# EAGLE design main (EAGLE 8.7.0)
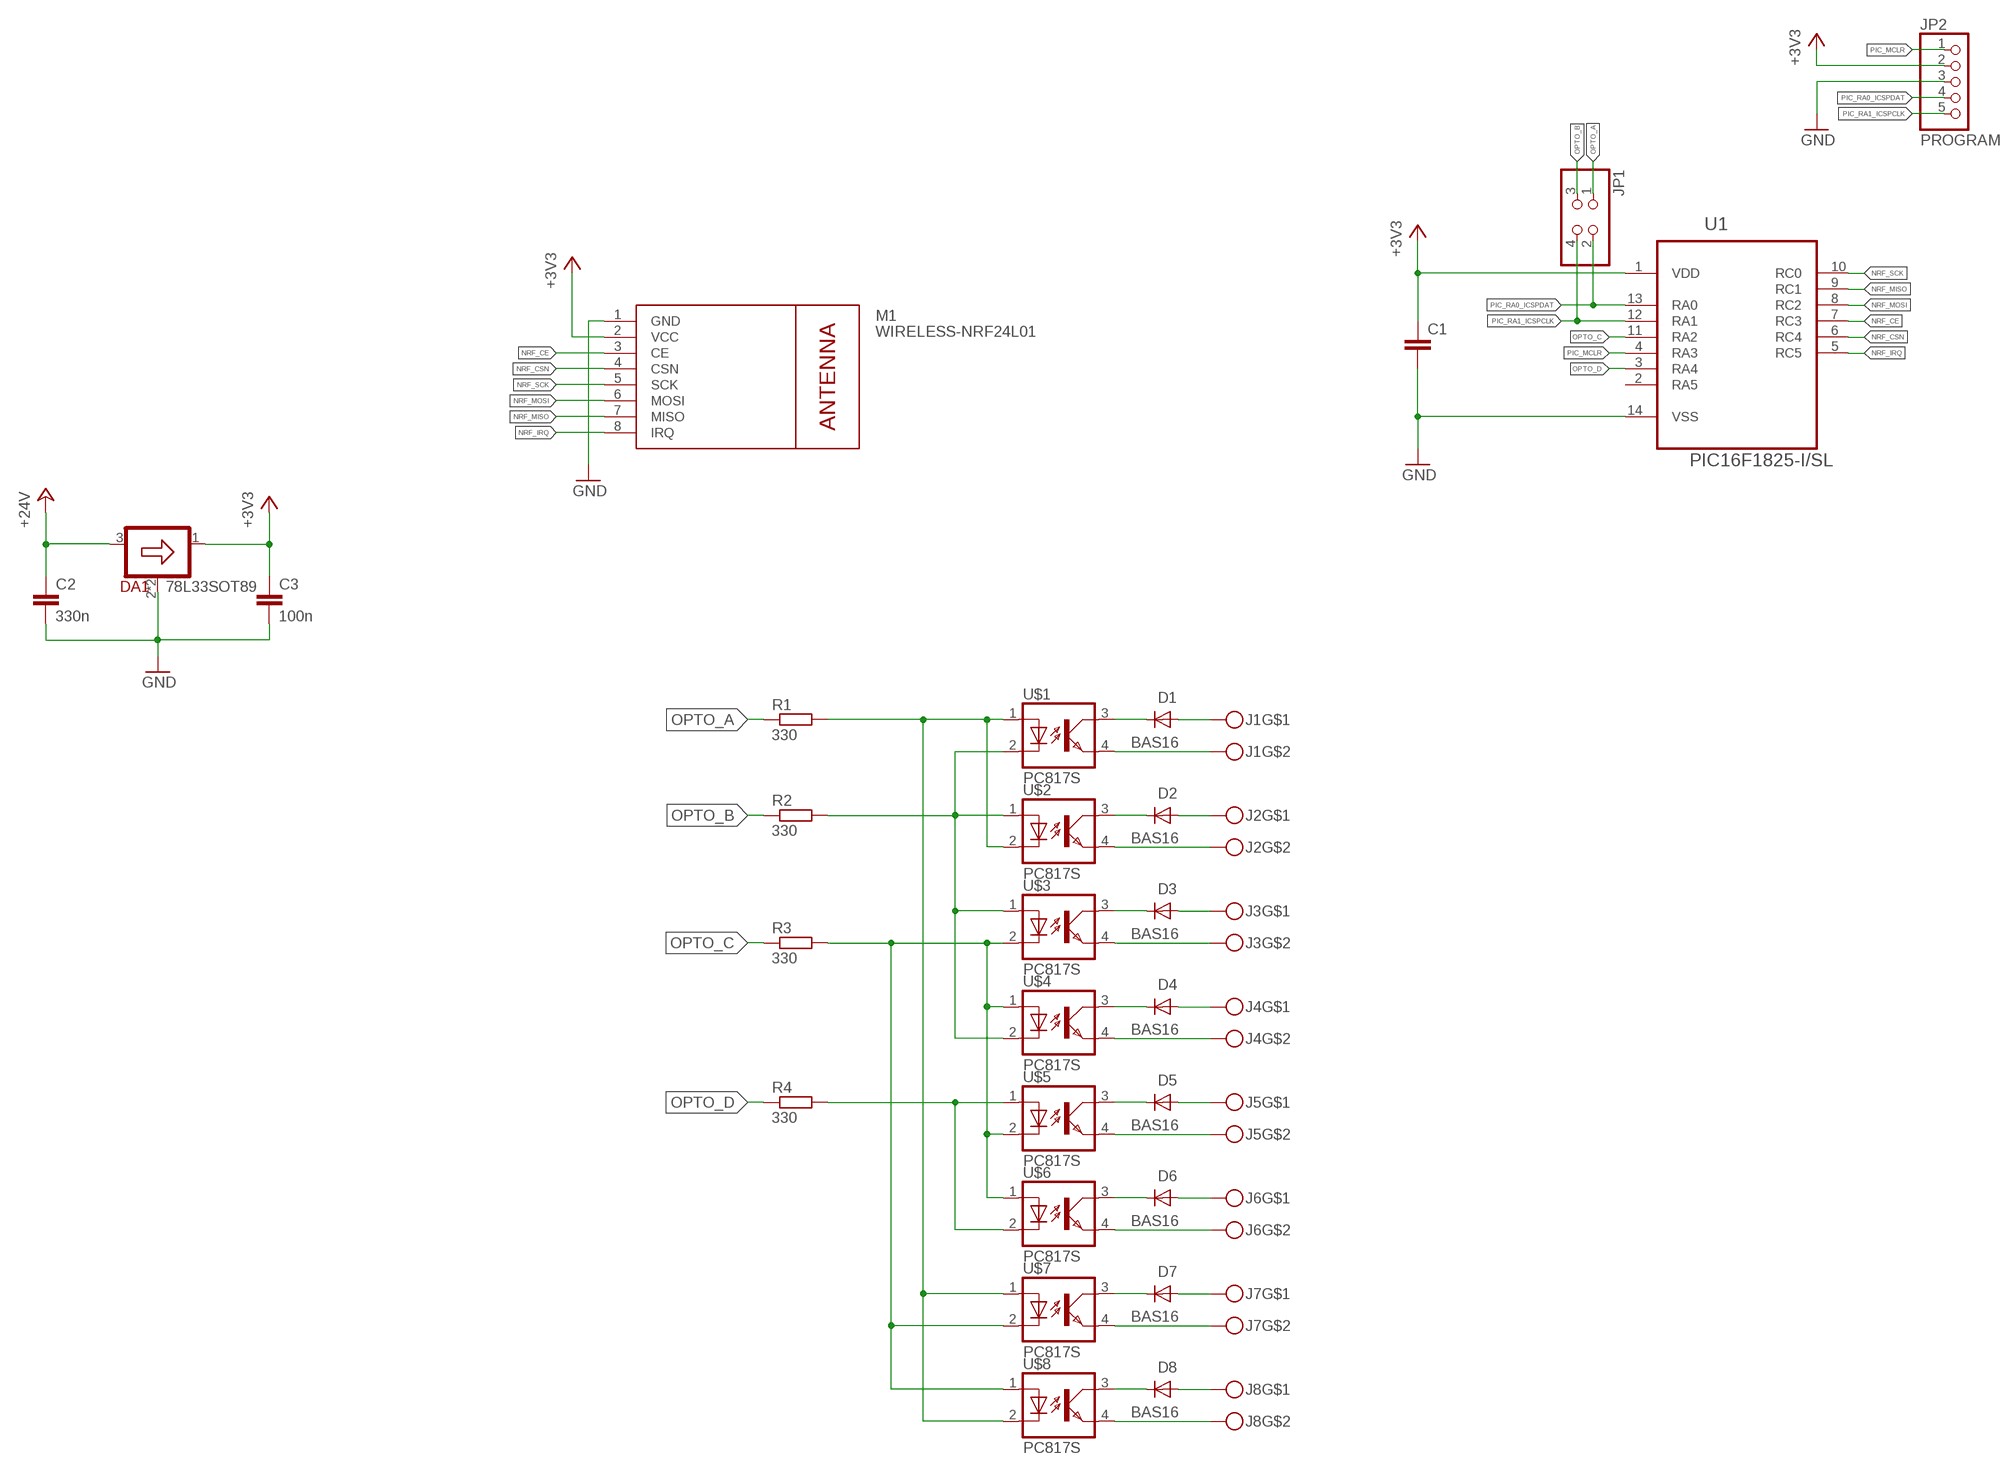
[diagram p0: schematic, sheet 1]

## Parts
C1  C-EUC1206  [C1206]
C2  330n  C-EUC1206  [C1206]
C3  100n  C-EUC1206  [C1206]
D1  BAS16  [SOT23]
D2  BAS16  [SOT23]
D3  BAS16  [SOT23]
D4  BAS16  [SOT23]
D5  BAS16  [SOT23]
D6  BAS16  [SOT23]
D7  BAS16  [SOT23]
D8  BAS16  [SOT23]
DA1  78L33SOT89  [SOT89]
J1  SCREW-TERMINAL-2PIN  [PITCH4.3-PIN2]
J2  SCREW-TERMINAL-2PIN  [PITCH4.3-PIN2]
J3  SCREW-TERMINAL-2PIN  [PITCH4.3-PIN2]
J4  SCREW-TERMINAL-2PIN  [PITCH4.3-PIN2]
J5  SCREW-TERMINAL-2PIN  [PITCH4.3-PIN2]
J6  SCREW-TERMINAL-2PIN  [PITCH4.3-PIN2]
J7  SCREW-TERMINAL-2PIN  [PITCH4.3-PIN2]
J8  SCREW-TERMINAL-2PIN  [PITCH4.3-PIN2]
JP1  PINHD-2X2  [2X02]
JP2  PROGRAM  PINHD-1X5  [1X05]
M1  WIRELESS-NRF24L01  [WIRELESS-NRF24L01]
R1  330  R-EU_R1206  [R1206]
R2  330  R-EU_R1206  [R1206]
R3  330  R-EU_R1206  [R1206]
R4  330  R-EU_R1206  [R1206]
U1  PIC16F1825-I/SL  [SOIC127P600X175-14N]
U$1  PC817S  [SMD4-7]
U$2  PC817S  [SMD4-7]
U$3  PC817S  [SMD4-7]
U$4  PC817S  [SMD4-7]
U$5  PC817S  [SMD4-7]
U$6  PC817S  [SMD4-7]
U$7  PC817S  [SMD4-7]
U$8  PC817S  [SMD4-7]

## Nets
+3V3: C1.1 C3.1 DA1.1(OUT) JP2.2 M1.2(VCC) U1.1(VDD)
+24V: C2.1 DA1.3(IN)
GND: C1.2 C2.2 C3.2 DA1.2(GND) DA1.2@1(GND) JP2.3 M1.1(GND) U1.14(VSS)
N$1: R2.2 U$1.2(C) U$2.1(A) U$3.1(A) U$4.2(C)
N$2: R1.2 U$1.1(A) U$2.2(C) U$7.1(A) U$8.2(C)
N$3: R3.2 U$3.2(C) U$4.1(A) U$5.2(C) U$6.1(A) U$7.2(C) U$8.1(A)
N$4: R4.2 U$5.1(A) U$6.2(C)
N$5: D1.3(K) U$1.3(COL)
N$6: D2.3(K) U$2.3(COL)
N$7: D3.3(K) U$3.3(COL)
N$8: D4.3(K) U$4.3(COL)
N$9: D1.1(A) J1.1
N$10: J1.2 U$1.4(EMIT)
N$11: D2.1(A) J2.1
N$12: J2.2 U$2.4(EMIT)
N$13: D3.1(A) J3.1
N$14: J3.2 U$3.4(EMIT)
N$15: D4.1(A) J4.1
N$16: J4.2 U$4.4(EMIT)
N$21: D5.3(K) U$5.3(COL)
N$22: D6.3(K) U$6.3(COL)
N$23: D7.3(K) U$7.3(COL)
N$24: D8.3(K) U$8.3(COL)
N$25: D5.1(A) J5.1
N$26: J5.2 U$5.4(EMIT)
N$27: D6.1(A) J6.1
N$28: J6.2 U$6.4(EMIT)
N$29: D7.1(A) J7.1
N$30: J7.2 U$7.4(EMIT)
N$31: D8.1(A) J8.1
N$32: J8.2 U$8.4(EMIT)
NRF_CE: M1.3(CE) U1.7(RC3)
NRF_CSN: M1.4(CSN) U1.6(RC4)
NRF_IRQ: M1.8(IRQ) U1.5(RC5)
NRF_MISO: M1.7(MISO) U1.9(RC1)
NRF_MOSI: M1.6(MOSI) U1.8(RC2)
NRF_SCK: M1.5(SCK) U1.10(RC0)
OPTO_A: JP1.1 R1.1
OPTO_B: JP1.3 R2.1
OPTO_C: R3.1 U1.11(RA2)
OPTO_D: R4.1 U1.3(RA4)
PIC_MCLR: JP2.1 U1.4(RA3)
PIC_RA0_ICSPDAT: JP1.2 JP2.4 U1.13(RA0)
PIC_RA1_ICSPCLK: JP1.4 JP2.5 U1.12(RA1)
Unconnected: U1.2(RA5)

## Library data of the parts
C1-C3 = rcl:C-EU: CAPACITOR, European symbol; SPICEPREFIX: C
D1-D8 = nxp_60:BAS16: High-speed switching diode High-speed switching diode, encapsulated in small Surface-Mounted Device (SMD) plastic packages. AAL Eindhoven MK
DA1 = regulators-linear:78L33
J1-J8 = screw-terminal:SCREW-TERMINAL-2PIN
JP1 = pinhead:PINHD-2X2: PIN HEADER
JP2 = pinhead:PINHD-1X5: PIN HEADER
M1 = diy-modules:WIRELESS-NRF24L01: 2.4 GHz Wireless Module based on NRF24L01 chip More details available here: http://www.electrodragon.com/w/NRF24L01 Click here to find device on ebay.com <http://www.ebay.com/sch/nrf24l01+arduino>
R1-R4 = rcl:R-EU_: RESISTOR, European symbol; SPICEPREFIX: R
U1 = Farnell-Microchip-PIC16F1825-I_SL:PIC16F1825-I/SL: IC, 8BIT MCU, PIC16F, 32MHz, SOIC-14; MPN: PIC16F1825-I/SL; OC_FARNELL: 1841448; OC_NEWARK: 82R4372; PACKAGE: SOIC-14; SUPPLIER: Microchip
U$1-U$8 = optocoupler-3-jcn:PC817S

## Board
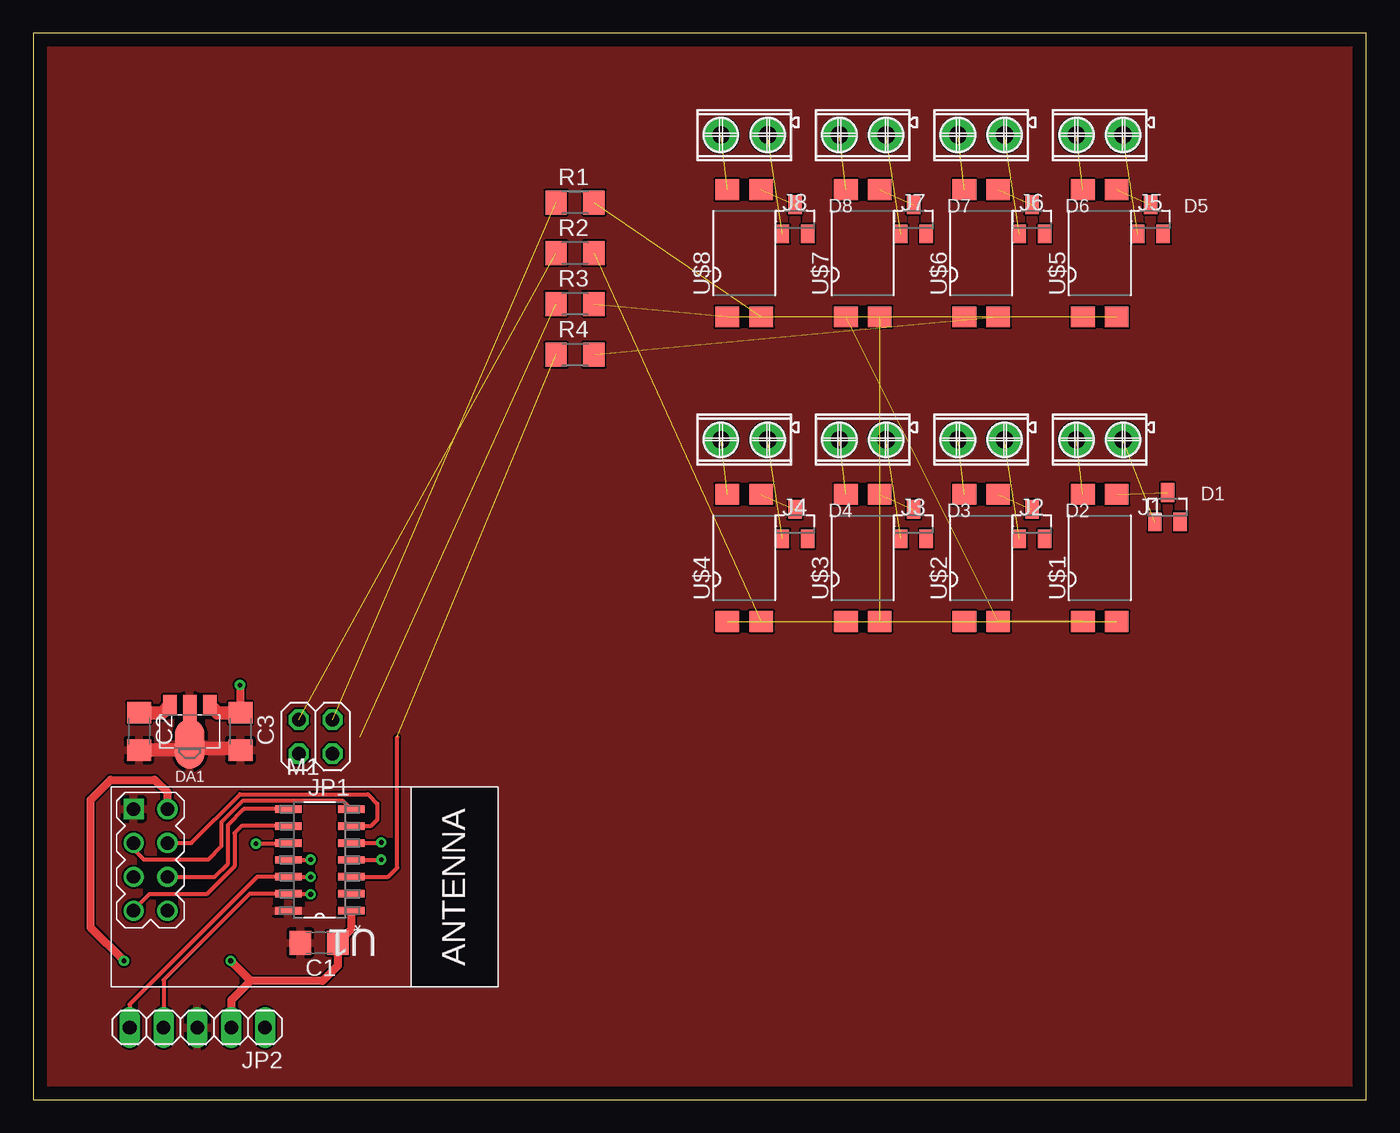
[diagram p1: board, top side]
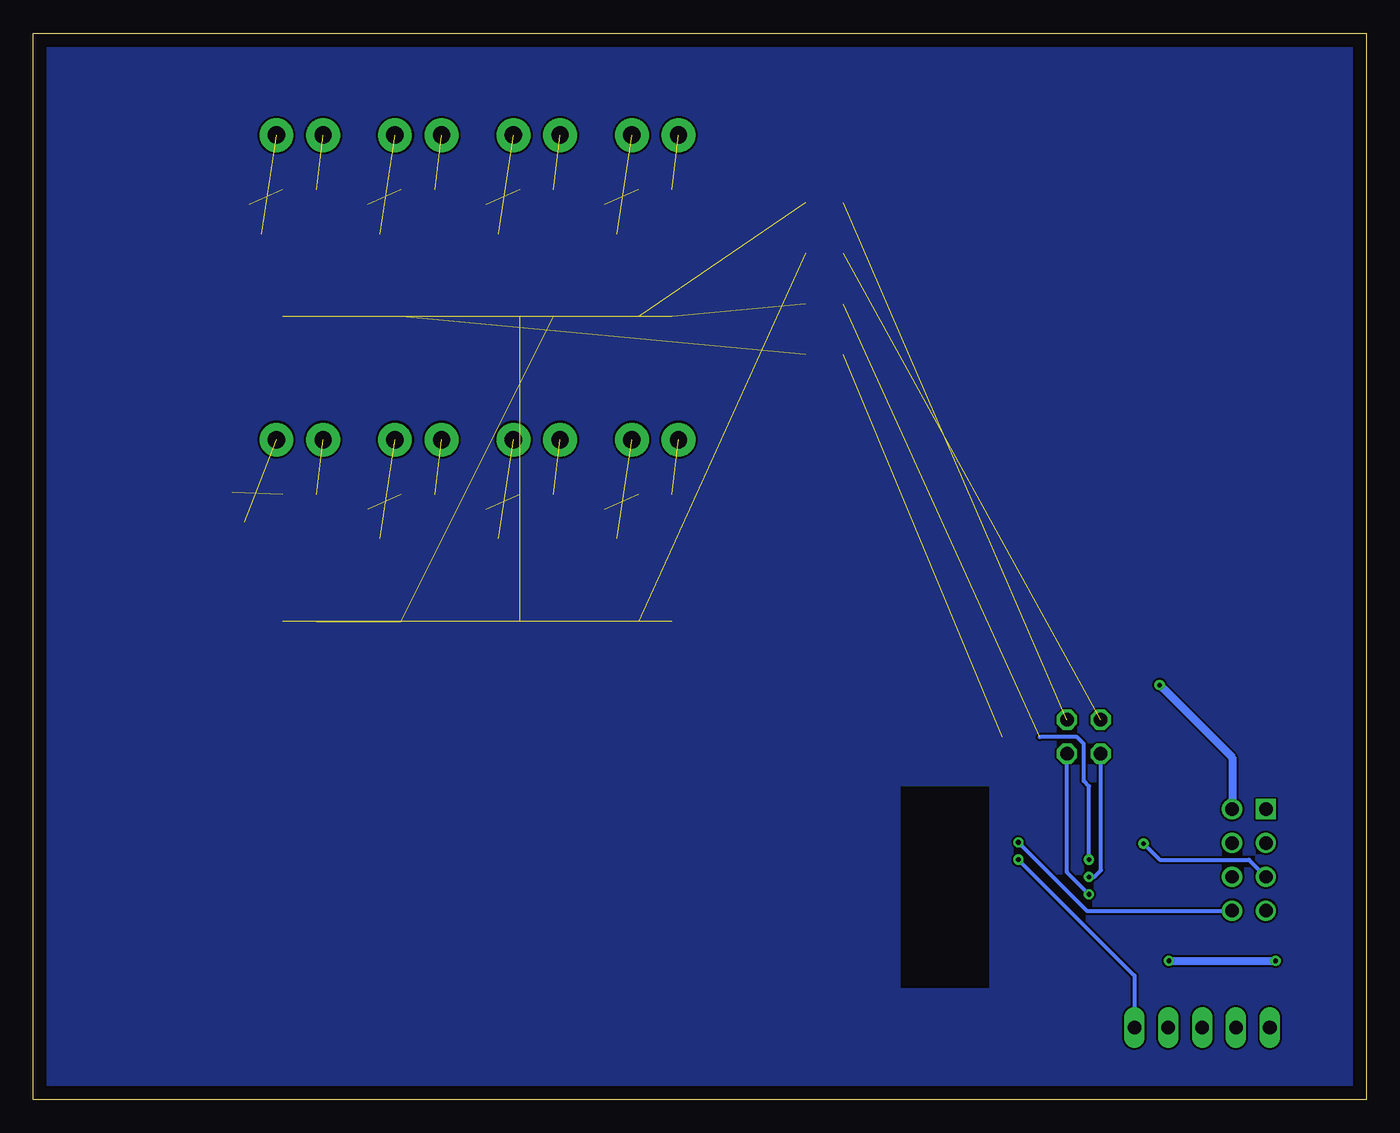
[diagram p2: board, bottom side, seen from below]

Size 100 x 80 mm. Coordinates in mm from the lower left corner, seen from the top.
Outline: 0,0 100,0 100,80 0,80 0,0
Copper layers (1*16): Top 0.035mm / dielectric 1.5mm / Bottom 0.035mm
Design rules "default": minimum track width 6mil, minimum drill 0.35mm, track to track 6mil, track to pad 6mil, pad to pad 6mil, via to via 6mil, smd to smd 6mil, copper to edge 40mil, drill to drill 6mil, minimum pad ring 10mil, minimum via ring 8mil, stop-mask expansion 4mil, vias tented up to drill 0mil, thermal gap 10mil
tRestrict: area 28.3,8.4 to 34.9,23.5
bRestrict: area 28.3,8.4 to 34.9,23.5

### Footprints (pad centres in the part's own frame; a part is rotated, then mirrored left to right if it is on the bottom)
C1206 = smd 1.6 x 1.8: 1 -1.4,0; 2 1.4,0
SOT23 = smd 1 x 1.4: 1 -0.95,-1.1; 2 0.95,-1.1; 3 0,1.1
SOT89 = smd 1 x 1.5: 1 -1.499,-1.981; 3 1.499,-1.981 | smd 1 x 2: 2 0,-1.727 | smd 2.2 x 3.7: 2@1 0,0.94
PITCH4.3-PIN2 = drill 1.3 pad 2.54: 1 -1.75,0.025; 2 1.75,0.025
2X02 = drill 1.016 octagon: 1 -1.27,-1.27; 2 -1.27,1.27; 3 1.27,-1.27; 4 1.27,1.27
1X05 = drill 1.016 long: 1 -5.08,0; 2 -2.54,0; 3 0,0; 4 2.54,0; 5 5.08,0
WIRELESS-NRF24L01 = drill 1 square: 1 -12.7,6.35 | drill 1: 2 -10.16,6.35; 3 -12.7,3.81; 4 -10.16,3.81; 5 -12.7,1.27; 6 -10.16,1.27; 7 -12.7,-1.27; 8 -10.16,-1.27
R1206 = smd 1.6 x 1.803: 1 -1.422,0; 2 1.422,0
SOIC127P600X175-14N = smd 1.981 x 0.559: 1 -2.362,3.81; 2 -2.362,2.54; 3 -2.362,1.27; 4 -2.362,0; 5 -2.362,-1.27; 6 -2.362,-2.54; 7 -2.362,-3.81; 8 2.362,-3.81; 9 2.362,-2.54; 10 2.362,-1.27; 11 2.362,0; 12 2.362,1.27; 13 2.362,2.54; 14 2.362,3.81
SMD4-7 = smd 1.78 x 1.55: 1 -1.27,-4.77; 2 1.27,-4.77; 3 1.27,4.77; 4 -1.27,4.77

### Placement (x,y rotation side)
C1  21.44,11.77 180 top
C2  7.93,27.62 270 top
C3  15.55,27.62 270 top
D1  85.09,44.45 0 top
D2  74.93,43.18 0 top
D3  66.04,43.18 0 top
D4  57.15,43.18 0 top
D5  83.82,66.04 0 top
D6  74.93,66.04 0 top
D7  66.04,66.04 0 top
D8  57.15,66.04 0 top
DA1  11.74,27.62 180 top
J1  80.01,49.53 180 top
J2  71.12,49.53 180 top
J3  62.23,49.53 180 top
J4  53.34,49.53 180 top
J5  80.01,72.39 180 top
J6  71.12,72.39 180 top
J7  62.23,72.39 180 top
J8  53.34,72.39 180 top
JP1  21.18,27.22 180 top
JP2  12.31,5.41 180 top
M1  20.22,15.44 0 top
R1  40.64,67.31 0 top
R2  40.64,63.5 0 top
R3  40.64,59.69 0 top
R4  40.64,55.88 0 top
U1  21.49,17.98 180 top
U$1  80.01,40.64 0 top
U$2  71.12,40.64 0 top
U$3  62.23,40.64 0 top
U$4  53.34,40.64 0 top
U$5  80.01,63.5 0 top
U$6  71.12,63.5 0 top
U$7  62.23,63.5 0 top
U$8  53.34,63.5 0 top

### Tracks (layer width: path | path; a pad name or v marks a point on that pad's centre or on a via)
+3V3  (via drill 0.35)
  Top 0.61: U1.1 23.85,12.78 C1.1 22.84,10.04 21.7,8.9 16.3,8.9 | JP2.2 14.85,7.45 16.3,8.9 | C3.1 15.55,31.05 v15.5,31.1 | 16.3,8.9 v14.8,10.4 | v6.8,10.4 4.3,12.9 4.3,22.5 5.8,24 9.1,24 10.1,23 10.06,22.96 M1.2
  Top 1.016: DA1.1 13.82,29.02 C3.1
  Bottom 0.61: v15.5,31.1 10.06,25.66 M1.2 | v14.8,10.4 v6.8,10.4
+24V
  Top 1.016: DA1.3 9.66,29.02 C2.1
GND
  Top 0.61: C3.2 15.42,26.35 | 11.61,26.22 11.74,26.35
  Top 1.016: 15.42,26.35 11.74,26.35 DA1.2@1 | C2.2 11.61,26.22
  pour Top: 0,80.01 0,0 100.33,0 100.33,80.01
N$1  (4 unrouted)
N$2  (4 unrouted)
N$3  (6 unrouted)
N$4  (2 unrouted)
N$5  (1 unrouted)
N$6  (1 unrouted)
N$7  (1 unrouted)
N$8  (1 unrouted)
N$9  (1 unrouted)
N$10  (1 unrouted)
N$11  (1 unrouted)
N$12  (1 unrouted)
N$13  (1 unrouted)
N$14  (1 unrouted)
N$15  (1 unrouted)
N$16  (1 unrouted)
N$17
  pour Bottom: 0,80.01 0,0 100.33,0 100.33,80.01
N$21  (1 unrouted)
N$22  (1 unrouted)
N$23  (1 unrouted)
N$24  (1 unrouted)
N$25  (1 unrouted)
N$26  (1 unrouted)
N$27  (1 unrouted)
N$28  (1 unrouted)
N$29  (1 unrouted)
N$30  (1 unrouted)
N$31  (1 unrouted)
N$32  (1 unrouted)
NRF_CE
  Top 0.305: U1.7 23.24,22.4 15.7,22.4 14.1,20.8 14.1,19 13.1,18 8.3,18 7.52,18.78 M1.3
NRF_CSN
  Top 0.305: M1.4 11.85,19.25 15.5,22.9 25.1,22.9 25.8,22.2 25.8,21 25.3,20.5 23.87,20.5 U1.6
NRF_IRQ  (via drill 0.35)
  Top 0.305: U1.5 26.05,19.25 v26.1,19.3
  Bottom 0.305: v26.1,19.3 20.97,14.17 M1.8
NRF_MISO
  Top 0.305: U1.9 15.62,20.52 15.1,20 15.1,17.5 13,15.4 8.7,15.4 7.52,14.22 M1.7
NRF_MOSI
  Top 0.305: U1.8 15.79,21.79 14.6,20.6 14.6,17.7 13.61,16.71 M1.6
NRF_SCK  (via drill 0.35)
  Top 0.305: U1.10 19.08,19.2 v16.7,19.2
  Bottom 0.305: v16.7,19.2 15.5,18 8.8,18 M1.5
OPTO_A  (1 unrouted)
OPTO_B  (1 unrouted)
OPTO_C  (via drill 0.35)  (1 unrouted)
  Top 0.305: U1.11 19.15,18 v20.8,18
  Bottom 0.305: v20.8,18 20.8,23.5 21.2,23.9 21.2,26.7 21.7,27.2 24.5,27.2
OPTO_D  (1 unrouted)
  Top 0.305: U1.3 26.61,16.71 27.3,17.4 27.3,27.2
PIC_MCLR  (via drill 0.35)
  Top 0.305: U1.4 26.08,17.98 v26.1,18
  Bottom 0.305: v26.1,18 17.39,9.29 JP2.1
PIC_RA0_ICSPDAT  (via drill 0.35)
  Top 0.305: JP2.4 9.77,8.97 16.24,15.44 U1.13 20.76,15.44 v20.8,15.4
  Bottom 0.305: v20.8,15.4 22.45,17.05 JP1.2
PIC_RA1_ICSPCLK  (via drill 0.35)
  Top 0.305: JP2.5 7.23,7.13 16.81,16.71 U1.12 20.69,16.71 20.7,16.7 v20.8,16.7
  Bottom 0.305: v20.8,16.7 20.4,16.7 19.9,17.2 JP1.4